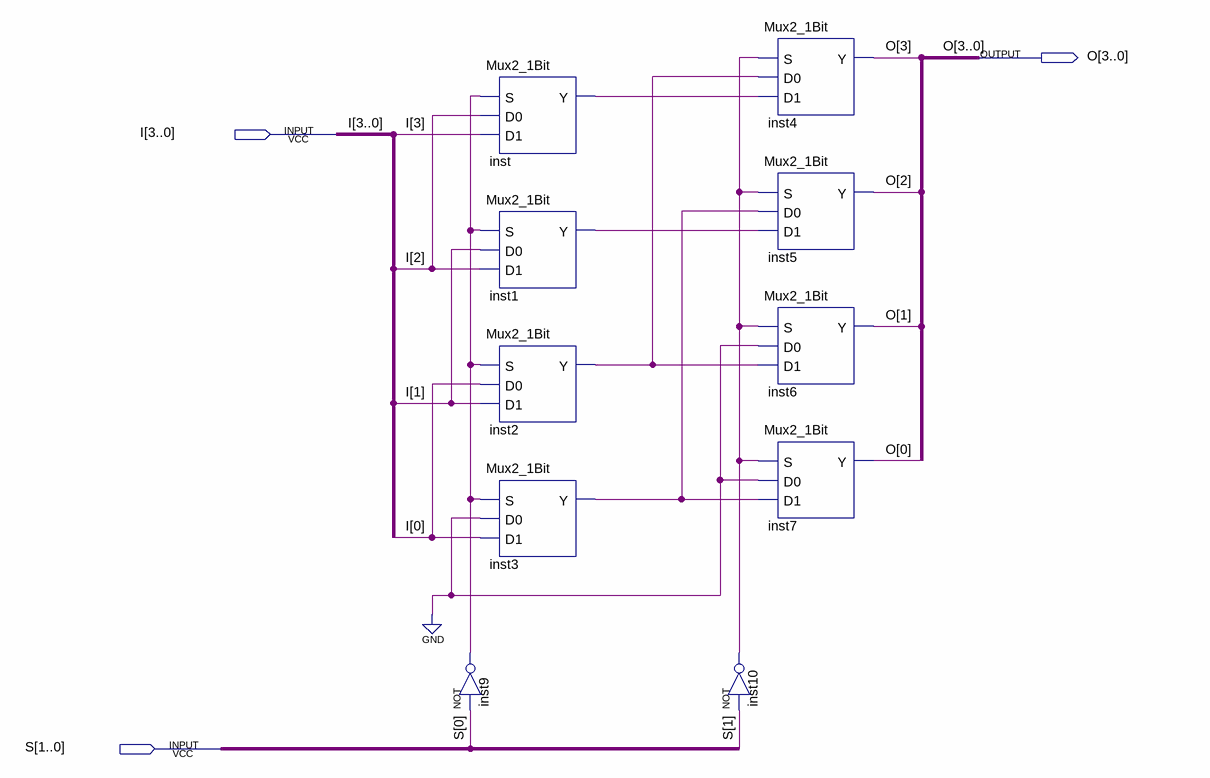
[diagram p0: schematic sheet]
// Quartus schematic ShiftLeft4.bdf as structural Verilog: 10 symbols, 3 pins
module ShiftLeft4 (
  input  [3:0] I,
  input  [1:0] S,
  output [3:0] O
);

  wire inst1_y, inst2_y, inst3_y, inst9_out, inst10_out, inst_y;

  Mux2_1Bit inst (.S(inst9_out), .D0(I[2]), .D1(I[3]), .Y(inst_y));
  Mux2_1Bit inst1 (.S(inst9_out), .D0(I[1]), .D1(I[2]), .Y(inst1_y));
  Mux2_1Bit inst2 (.S(inst9_out), .D0(I[0]), .D1(I[1]), .Y(inst2_y));
  Mux2_1Bit inst3 (.S(inst9_out), .D0(1'b0), .D1(I[0]), .Y(inst3_y));
  not inst9 (inst9_out, S[0]);
  Mux2_1Bit inst4 (.S(inst10_out), .D0(inst2_y), .D1(inst_y), .Y(O[3]));
  Mux2_1Bit inst5 (.S(inst10_out), .D0(inst3_y), .D1(inst1_y), .Y(O[2]));
  Mux2_1Bit inst6 (.S(inst10_out), .D0(1'b0), .D1(inst2_y), .Y(O[1]));
  Mux2_1Bit inst7 (.S(inst10_out), .D0(1'b0), .D1(inst3_y), .Y(O[0]));
  not inst10 (inst10_out, S[1]);
endmodule
